# Altium schematic sheet 23_MOUNTING_HOLE.SchDoc
size 420 x 297 mm; SheetNumber: 23; SheetTotal: 23
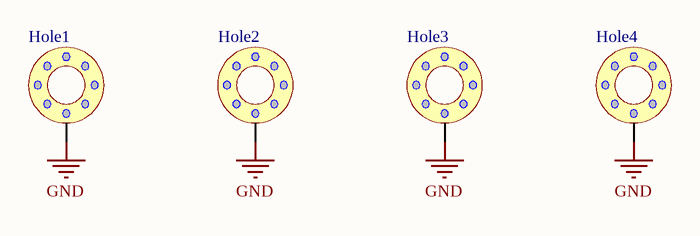
[diagram p0: 23_MOUNTING_HOLE.SchDoc]

## Parts
Hole1  hole_space  [HEX-M3_NoVia]  (value not drawn)
Hole2  hole_space  [HEX-M3_NoVia]  (value not drawn)
Hole3  hole_space  [HEX-M3_NoVia]  (value not drawn)
Hole4  hole_space  [HEX-M3_NoVia]  (value not drawn)

## Nets
GND: Hole1.1 Hole2.1 Hole3.1 Hole4.1

## Notes on the sheet
- Project
- Sub-system:
- Design by:
- Sheet title:
- Sheet:
- of
- Checked by:
- Approved by:
- Doc no:
- Revision
- Size:
- Date: